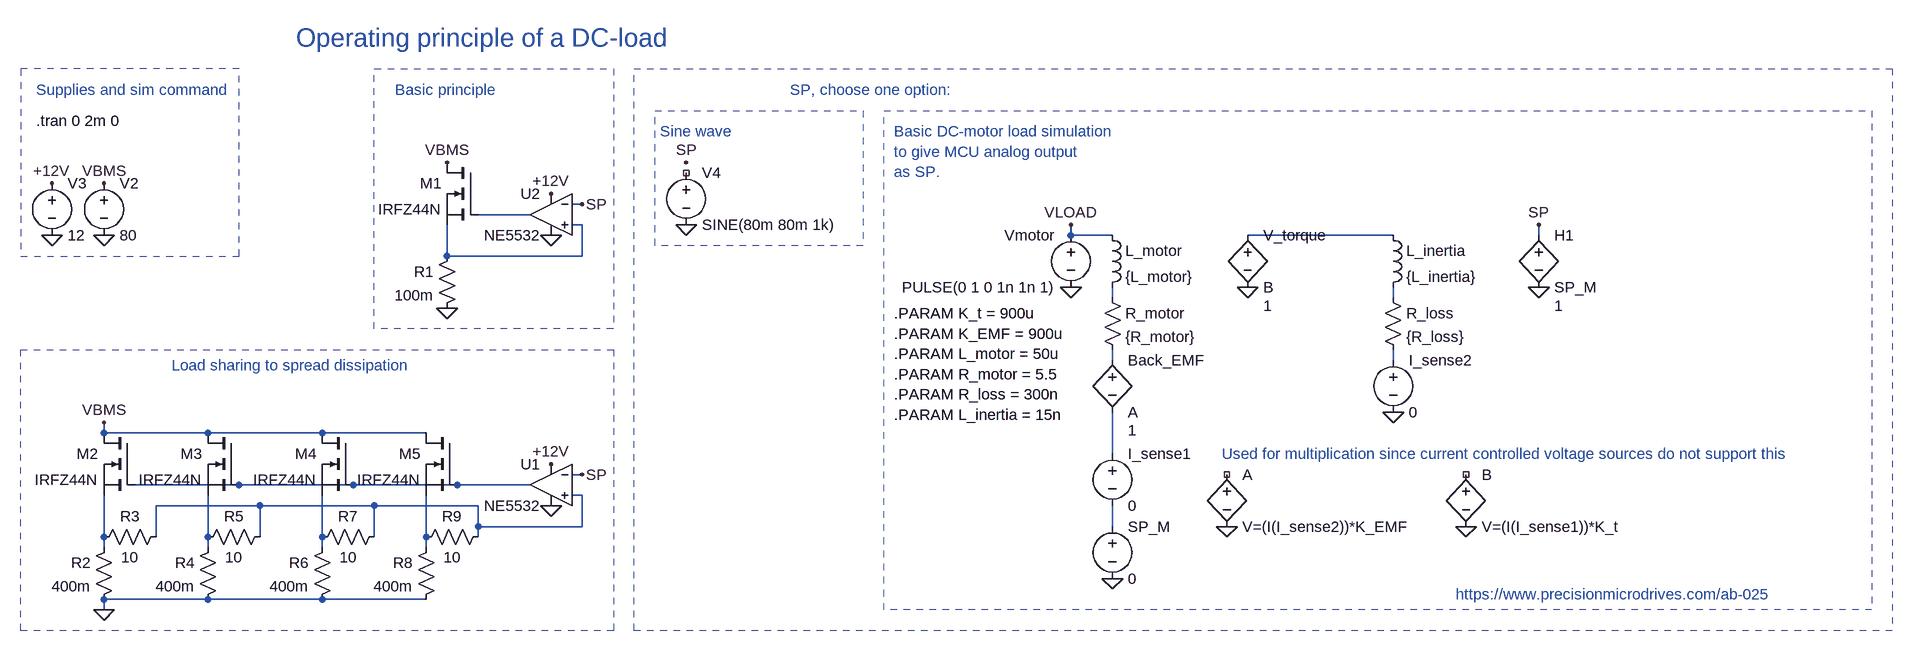
[diagram p0: schematic DC-load.asc]
DC-load.asc, the LTspice schematic file:
Version 4
SHEET 1 2508 800
WIRE 288 48 272 48
WIRE 208 64 128 64
WIRE 288 80 272 80
WIRE 1040 96 1040 80
WIRE 1104 96 1040 96
WIRE 1536 96 1312 96
WIRE 1760 96 1760 80
WIRE 80 128 80 80
WIRE 288 128 288 80
WIRE 288 128 80 128
WIRE 1104 192 1104 176
WIRE 1536 192 1536 176
WIRE 1104 288 1104 272
WIRE 1536 288 1536 272
WIRE -448 400 -448 384
WIRE -288 400 -448 400
WIRE -112 400 -288 400
WIRE 48 400 -112 400
WIRE 1104 432 1104 368
WIRE 288 464 272 464
WIRE -240 480 -400 480
WIRE -64 480 -240 480
WIRE 96 480 -64 480
WIRE 208 480 96 480
WIRE 288 496 272 496
WIRE -208 512 -368 512
WIRE -32 512 -208 512
WIRE 128 512 -32 512
WIRE 128 544 128 512
WIRE 288 544 288 496
WIRE 288 544 128 544
WIRE 1104 544 1104 512
WIRE -448 560 -448 496
WIRE -368 560 -368 512
WIRE -288 560 -288 496
WIRE -208 560 -208 512
WIRE -112 560 -112 496
WIRE -32 560 -32 512
WIRE 48 560 48 496
WIRE 128 560 128 544
WIRE -448 576 -448 560
WIRE -288 576 -288 560
WIRE -112 576 -112 560
WIRE 48 576 48 560
WIRE -288 656 -448 656
WIRE -112 656 -288 656
WIRE 48 656 -112 656
WIRE -448 672 -448 656
FLAG 80 208 0
FLAG 80 -16 VBMS
FLAG -448 16 VBMS
FLAG -448 96 0
FLAG -528 16 +12V
FLAG -528 96 0
FLAG 240 32 +12V
FLAG 240 96 0
FLAG -448 672 0
FLAG -448 384 VBMS
FLAG 240 448 +12V
FLAG 240 512 0
FLAG 448 -16 SP
FLAG 448 80 0
FLAG 288 48 SP
FLAG 288 464 SP
FLAG 1040 80 VLOAD
FLAG 1040 176 0
FLAG 1104 624 0
FLAG 1760 80 SP
FLAG 1760 176 0
FLAG 1312 176 0
FLAG 1536 368 0
FLAG 1648 544 0
FLAG 1280 544 0
SYMBOL res 96 112 M0
SYMATTR InstName R1
SYMATTR Value 100m
SYMBOL voltage -448 0 R0
WINDOW 123 0 0 Left 0
WINDOW 39 0 0 Left 0
SYMATTR InstName V2
SYMATTR Value 80
SYMBOL voltage -528 0 R0
WINDOW 123 0 0 Left 0
WINDOW 39 0 0 Left 0
SYMATTR InstName V3
SYMATTR Value 12
SYMBOL mylib\\Opamps\\NE5532 240 64 M0
SYMATTR InstName U2
SYMBOL nmos 128 -16 M0
SYMATTR InstName M1
SYMATTR Value IRFZ44N
SYMBOL res -432 560 M0
SYMATTR InstName R2
SYMATTR Value 400m
SYMBOL mylib\\Opamps\\NE5532 240 480 M0
SYMATTR InstName U1
SYMBOL nmos -400 400 M0
SYMATTR InstName M2
SYMATTR Value IRFZ44N
SYMBOL res -352 544 R90
WINDOW 0 0 56 VBottom 2
WINDOW 3 32 56 VTop 2
SYMATTR InstName R3
SYMATTR Value 10
SYMBOL res -272 560 M0
SYMATTR InstName R4
SYMATTR Value 400m
SYMBOL nmos -240 400 M0
SYMATTR InstName M3
SYMATTR Value IRFZ44N
SYMBOL res -192 544 R90
WINDOW 0 0 56 VBottom 2
WINDOW 3 32 56 VTop 2
SYMATTR InstName R5
SYMATTR Value 10
SYMBOL res -96 560 M0
SYMATTR InstName R6
SYMATTR Value 400m
SYMBOL nmos -64 400 M0
SYMATTR InstName M4
SYMATTR Value IRFZ44N
SYMBOL res -16 544 R90
WINDOW 0 0 56 VBottom 2
WINDOW 3 32 56 VTop 2
SYMATTR InstName R7
SYMATTR Value 10
SYMBOL res 64 560 M0
SYMATTR InstName R8
SYMATTR Value 400m
SYMBOL nmos 96 400 M0
SYMATTR InstName M5
SYMATTR Value IRFZ44N
SYMBOL res 144 544 R90
WINDOW 0 0 56 VBottom 2
WINDOW 3 32 56 VTop 2
SYMATTR InstName R9
SYMATTR Value 10
SYMBOL ind 1088 80 R0
SYMATTR InstName L_motor
SYMATTR Value {L_motor}
SYMBOL voltage 448 -16 R0
WINDOW 123 0 0 Left 0
WINDOW 39 0 0 Left 0
SYMATTR InstName V4
SYMATTR Value SINE(80m 80m 1k)
SYMBOL voltage 1040 80 M0
WINDOW 123 0 0 Left 0
WINDOW 39 0 0 Left 0
SYMATTR InstName Vmotor
SYMATTR Value PULSE(0 1 0 1n 1n 1)
SYMBOL h 1760 80 R0
WINDOW 123 24 124 Left 2
SYMATTR Value2 1
SYMATTR InstName H1
SYMATTR Value SP_M
SYMBOL voltage 1104 528 R0
WINDOW 123 0 0 Left 0
WINDOW 39 0 0 Left 0
SYMATTR InstName SP_M
SYMATTR Value 0
SYMBOL res 1088 176 R0
SYMATTR InstName R_motor
SYMATTR Value {R_motor}
SYMBOL voltage 1104 416 R0
WINDOW 123 0 0 Left 0
WINDOW 39 0 0 Left 0
SYMATTR InstName I_sense1
SYMATTR Value 0
SYMBOL h 1312 80 R0
WINDOW 123 24 124 Left 2
SYMATTR Value2 1
SYMATTR InstName V_torque
SYMATTR Value B
SYMBOL ind 1520 80 R0
SYMATTR InstName L_inertia
SYMATTR Value {L_inertia}
SYMBOL res 1520 176 R0
SYMATTR InstName R_loss
SYMATTR Value {R_loss}
SYMBOL voltage 1536 272 R0
WINDOW 123 0 0 Left 0
WINDOW 39 0 0 Left 0
SYMATTR InstName I_sense2
SYMATTR Value 0
SYMBOL h 1104 272 R0
WINDOW 123 24 124 Left 2
SYMATTR Value2 1
SYMATTR InstName Back_EMF
SYMATTR Value A
SYMBOL bv 1280 448 R0
SYMATTR InstName A
SYMATTR Value V=(I(I_sense2))*K_EMF
SYMBOL bv 1648 448 R0
SYMATTR InstName B
SYMATTR Value V=(I(I_sense1))*K_t
TEXT -552 -80 Left 2 !.tran 0 2m 0
TEXT 0 -128 Left 2 ;Basic principle
TEXT -344 296 Left 2 ;Load sharing to spread dissipation
TEXT 768 -64 Left 2 ;Basic DC-motor load simulation\nto give MCU analog output\nas SP.
TEXT 608 -128 Left 2 ;SP, choose one option:
TEXT 408 -64 Left 2 ;Sine wave
TEXT 768 216 Left 2 !.PARAM K_t = 900u\n.PARAM K_EMF = 900u\n.PARAM L_motor = 50u\n.PARAM R_motor = 5.5\n.PARAM R_loss = 300n\n.PARAM L_inertia = 15n
TEXT 1632 648 Left 2 ;https://www.precisionmicrodrives.com/ab-025
TEXT 1272 432 Left 2 ;Used for multiplication since current controlled voltage sources do not support this
TEXT -552 -128 Left 2 ;Supplies and sim command
TEXT -152 -208 Left 4 ;Operating principle of a DC-load
RECTANGLE Normal 2272 672 752 -96 2
RECTANGLE Normal 720 112 400 -96 2
RECTANGLE Normal 368 -160 2304 704 2
RECTANGLE Normal 336 704 -576 272 2
RECTANGLE Normal 336 240 -32 -160 2
RECTANGLE Normal -240 -160 -576 128 2

The netlist it stands for:
* DC-load.asc
R1 N002 0 100m
V2 VBMS 0 80
V3 +12V 0 12
* U2: NE5532 (symbol mylib\Opamps\NE5532 not available, pins judged from their places): In+=N002 In-=SP V+=+12V V-=0 OUT=N001
M1 VBMS N001 N002 N002 IRFZ44N
R2 N012 0 400m
* U1: NE5532 (symbol mylib\Opamps\NE5532 not available, pins judged from their places): In+=N010 In-=SP V+=+12V V-=0 OUT=N009
M2 VBMS N009 N012 N012 IRFZ44N
R3 N010 N012 10
R4 N013 0 400m
M3 VBMS N009 N013 N013 IRFZ44N
R5 N010 N013 10
R6 N014 0 400m
M4 VBMS N009 N014 N014 IRFZ44N
R7 N010 N014 10
R8 N015 0 400m
M5 VBMS N009 N015 N015 IRFZ44N
R9 N010 N015 10
L_motor VLOAD N004 {L_motor}
V4 NC_01 0 SINE(80m 80m 1k)
Vmotor VLOAD 0 PULSE(0 1 0 1n 1n 1)
H1 SP 0 SP_M 1
V§SP_M N011 0 0
R_motor N004 N006 {R_motor}
V§I_sense1 N008 N011 0
H§V_torque N003 0 B 1
L_inertia N003 N005 {L_inertia}
R_loss N005 N007 {R_loss}
V§I_sense2 N007 0 0
H§Back_EMF N006 N008 A 1
B§A NC_02 0 V=(I(I_sense2))*K_EMF
B NC_03 0 V=(I(I_sense1))*K_t
.model NMOS NMOS
.model PMOS PMOS
.lib standard.mos
.tran 0 2m 0
* Basic principle
* Load sharing to spread dissipation
* Basic DC-motor load simulation
* to give MCU analog output
* as SP.
* SP, choose one option:
* Sine wave
.PARAM K_t = 900u
.PARAM K_EMF = 900u
.PARAM L_motor = 50u
.PARAM R_motor = 5.5
.PARAM R_loss = 300n
.PARAM L_inertia = 15n
* https://www.precisionmicrodrives.com/ab-025
* Used for multiplication since current controlled voltage sources do not support this
* Supplies and sim command
* Operating principle of a DC-load
.backanno
.end